# Altium schematic sheet POWER.SchDoc
size 420 x 297 mm; SheetNumber: 3; SheetTotal: 13
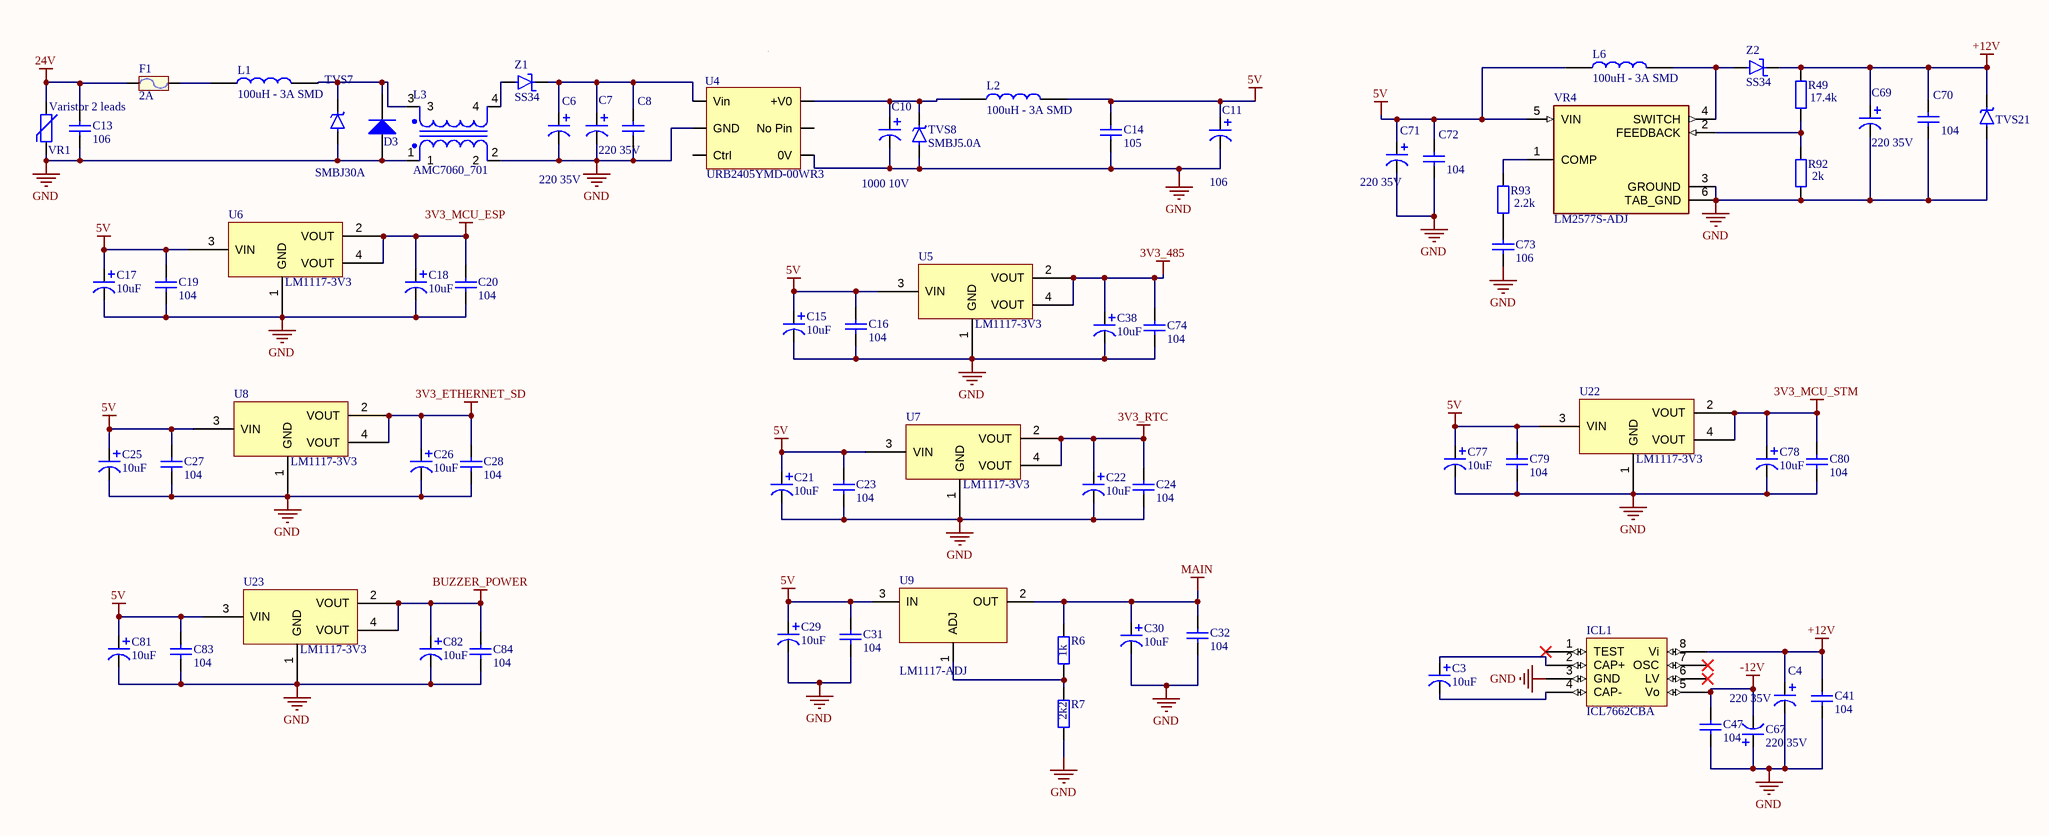
[diagram p0: POWER.SchDoc]

## Parts
C3  10uF  [1206_CAP]
C4  220 35V  [8x12 radial capacitor]
C6  220 35V  [8x12 radial capacitor]
C7  220 35V  [8x12 radial capacitor]
C8  105  [0805_Cap]  (value not drawn)
C10  1000 10V  [8x12 radial capacitor]
C11  106  [1206_CAP]
C13  106  [1206_CAP]
C14  105  [1206_CAP]
C15  10uF  [1206_CAP]
C16  104  [0603_Cap]
C17  10uF  [1206_CAP]
C18  10uF  [1206_CAP]
C19  104  [0603_Cap]
C20  104  [0603_Cap]
C21  10uF  [1206_CAP]
C22  10uF  [1206_CAP]
C23  104  [0603_Cap]
C24  104  [0603_Cap]
C25  10uF  [1206_CAP]
C26  10uF  [1206_CAP]
C27  104  [0603_Cap]
C28  104  [0603_Cap]
C29  10uF  [1206_CAP]
C30  10uF  [1206_CAP]
C31  104  [0603_Cap]
C32  104  [0603_Cap]
C38  10uF  [1206_CAP]
C41  104  [0603_Cap]
C47  104  [0603_Cap]
C67  220 35V  [8x12 radial capacitor]
C69  220 35V  [8x12 radial capacitor]
C70  104  [0805_Cap]
C71  220 35V  [8x12 radial capacitor]
C72  104  [0805_Cap]
C73  106  [1206_CAP]
C74  104  [0603_Cap]
C77  10uF  [1206_CAP]
C78  10uF  [1206_CAP]
C79  104  [0603_Cap]
C80  104  [0603_Cap]
C81  10uF  [1206_CAP]
C82  10uF  [1206_CAP]
C83  104  [0603_Cap]
C84  104  [0603_Cap]
D3  RS3M  [SMC - DO-214]  (value not drawn)
F1  2A  [Fuse4]
ICL1  ICL7662CBA  [ICL7662CBA]
L1  100uH - 3A SMD  [Cuon Cam 12x12x10]
L2  100uH - 3A SMD  [Cuon Cam 12x12x10]
L3  AMC7060_701  [Double inductor]
L6  100uH - 3A SMD  [Cuon Cam 12x12x10]
R6  1k  [0603_Res]
R7  2k2  [0603_Res]
R49  17.4k  [0603_Res]
R92  2k  [0603_Res]
R93  2.2k  [0603_Res]
TVS7  SMBJ30A  [SMC - DO-214]
TVS8  SMBJ5.0A  [SMB - DO-214AA]
TVS21  SMBJ30A  [SMC - DO-214]  (value not drawn)
U4  URB2405YMD-00WR3  [URB2405YMD-xxWR3]
U5  LM1117-3V3  [SOT-223]
U6  LM1117-3V3  [SOT-223]
U7  LM1117-3V3  [SOT-223]
U8  LM1117-3V3  [SOT-223]
U9  LM1117-ADJ  [LM1117-SOP]
U22  LM1117-3V3  [SOT-223]
U23  LM1117-3V3  [SOT-223]
VR1  Varistor 2 leads  [Varistor]
VR4  LM2577S-ADJ  [TO170P1524X483-6N]
Z1  SS34  [SMB - DO-214AA]
Z2  SS34  [SMB - DO-214AA]

## Nets
3V3_485: C38.1 C74.1 U5.2(VOUT) U5.4(VOUT)
3V3_ETHERNET_SD: C26.1 C28.1 U8.2(VOUT) U8.4(VOUT)
3V3_MCU_ESP: C18.1 C20.1 U6.2(VOUT) U6.4(VOUT)
3V3_MCU_STM: C78.1 C80.1 U22.2(VOUT) U22.4(VOUT)
3V3_RTC: C22.1 C24.1 U7.2(VOUT) U7.4(VOUT)
5V: C11.1 C14.1 C15.1 C16.1 C17.1 C19.1 C21.1 C23.1 C25.1 C27.1 C29.1 C31.1 C71.1 C72.1 C77.1 C79.1 C81.1 C83.1 L2.2 L6.1 U5.3(VIN) U6.3(VIN) U7.3(VIN) U8.3(VIN) U9.3(IN) U22.3(VIN) U23.3(VIN) VR4.5(VIN)
24V: C13.1 F1.1 VR1.1
+12V: C4.1 C41.1 C69.1 C70.1 ICL1.8(Vi) R49.2 TVS21.1 Z2.1
-12V: C47.1 C67.2 ICL1.5(Vo)
BUZZER_POWER: C82.1 C84.1 U23.2(VOUT) U23.4(VOUT)
GND: C4.2 C6.2 C7.2 C8.2 C10.2 C11.2 C13.2 C14.2 C15.2 C16.2 C17.2 C18.2 C19.2 C20.2 C21.2 C22.2 C23.2 C24.2 C25.2 C26.2 C27.2 C28.2 C29.2 C30.2 C31.2 C32.2 C38.2 C41.2 C47.2 C67.1 C69.2 C70.2 C71.2 C72.2 C73.2 C74.2 C77.2 C78.2 C79.2 C80.2 C81.2 C82.2 C83.2 C84.2 D3.2 ICL1.3(GND) L3.1 L3.2 R7.1 R92.1 TVS7.2 TVS8.2 TVS21.2 U4.2(GND) U4.6(0V) U5.1(GND) U6.1(GND) U7.1(GND) U8.1(GND) U22.1(GND) U23.1(GND) VR1.2 VR4.3(GROUND) VR4.6(TAB_GND)
MAIN: C30.1 C32.1 R6.2 U9.2(OUT)
NetC3_1: C3.1 ICL1.2(CAP+)
NetC3_2: C3.2 ICL1.4(CAP-)
NetC6_1: C6.1 C7.1 C8.1 U4.3(Vin) Z1.1
NetC10_1: C10.1 L2.1 TVS8.1 U4.4(+V0)
NetC73_1: C73.1 R93.1
NetD3_1: D3.1 L1.2 L3.3 TVS7.1
NetF1_2: F1.2 L1.1
NetL3_4: L3.4 Z1.2
NetL6_2: L6.2 VR4.4(SWITCH) Z2.2
NetR6_1: R6.1 R7.2 U9.1(ADJ)
NetR49_1: R49.1 R92.2 VR4.2(FEEDBACK)
NetR93_2: R93.2 VR4.1(COMP)

Not connected (* = marked no-connect by the designer): ICL1 1(TEST)* 6(LV)* 7(OSC)*; U4 1(Ctrl) 5(No_Pin)

## Notes on the sheet
- THIS DOCUMENT AND THE DATA DISCLOSED HEREIN OR
- HEREWITH IS THE PROPERTY OF ALTIUM LIMITED AND MAY
- DWG NO:
- REVISION
- REV:
- DESCRIPTION
- DATE
- APPROVED
- BE FREELY DISTRIBUTED IN WHOLE. NO RIGHTS ARE
- RESERVED OR EXPRESS OR IMPLIED WARANTEE GIVEN.
- ENG:
- APPROVALS
- PROJECT
- DSN:
- CHK:
- REFERENCE DOCUMENTS
- PROJECT REVISION:
- TITLE
- DOCUMENT REVISION:
- DESIGN ITEM:
- BOM:
- FAB DWG:
- PCB DWG:
- ASSY DWG:
- SCALE:
- A3
- SIZE
- CAGE CODE
- FILE NAME
- DWG NO.
- SHEET
- OF
- REV

## Library data of the parts
C3 C4 C6 C7 C10 C11 C15 C17 C18 C21 C22 C25 C26 C29 C30 C38 C67 C69 C71 C77 C78 C81 C82 = Polarized Capacitor
C8 C13 C14 C16 C19 C20 C23 C24 C27 C28 C31 C32 C41 C47 C70 C72-C74 C79 C80 C83 C84 = Ceramic Capacitor: Chung_Loai: Dán; Don_Vi: Con; So_Chan: 2; Ten_Linh_Kien: Tụ 0805 104-100nF 10% 50V; Ma_Hang: MH004551; Kieu_Chan: *
D3 = Diode: Ten_Linh_Kien: Diode S4 SOD123 ( 1N5819 SOD123); Ma_Hang: MH005519; Chung_Loai: Dán; Don_Vi: Con; Ghi_Chu: *; Kieu_Chan: *
F1 = Fuse: Designed by: VanDungEvn; Value: Fuse
L1 L2 L6 = CUON CAM 100uH SMD: Dán; Don_Vi: Con; Ma_Hang: MH003999; Ten_Linh_Kien: Cuộn Cảm 100uH 7x7x4MM CD74; Ma_Hang: *; Kieu_Chan: *; Chung_Loai: Dán
L3 = inductor_1: Common mode choke / cuon cam xuyen
R6 R7 R49 R92 R93 = Resistor: Chung_Loai: Dán; Don_Vi: Con; So_Chan: 2; Ten_Linh_Kien: Trở 0805 1% 1k; Ma_Hang: MH005468; Kieu_Chan: *
TVS7 TVS8 TVS21 = TVS Uni Diode
U5-U8 U22 U23 = LM1117-3V3: Value: AMS1117-3.3V SOT223; Don_Vi: Con; Ma_Hang: MH000596; Chung_Loai: Dán; Ghi_Chu: *; Kieu_Chan: *
U9 = LM1117-ADJ: 800mA Low-Dropout Linear Regulator; Creator: Nguyen Ba Bien; Website: http://group3i.net
VR1 = Varistor
VR4 = LM2577S-ADJ: SIMPLE SWITCHER&reg; 3.5V to 40V, 3A Low Component Count Step-Up Regulator 5-DDPAK/TO-263 -40 to 125; MF: Texas Instruments; Price: None; Package: TO-263-5 Texas Instruments; Purchase-URL: https://pricing.snapeda.com/search/part/LM2577S-ADJ/?ref=eda; Availability: In Stock; SnapEDA_Link: https://www.snapeda.com/parts/LM2577S-ADJ/Texas+Instruments/view-part/?ref=snap; Value: *; MP: LM2577S-ADJ; Check_prices: https://www.snapeda.com/parts/LM2577S-ADJ/Texas+Instruments/view-part/?ref=eda
Z1 Z2 = Zenner Diode: MP: 1SMA5926; MF: Taiwan Semiconductor; Package: SMA-2 Taiwan Semiconductor; Availability: In Stock; Purchase-URL: https://pricing.snapeda.com/search/part/1SMA5926/?ref=eda; SnapEDA_Link: https://www.snapeda.com/parts/1SMA5926/Taiwan+Semiconductor/view-part/?ref=snap; Price: None; Check_prices: https://www.snapeda.com/parts/1SMA5926/Taiwan+Semiconductor/view-part/?ref=eda; Value: *